# Altium project ST.PrjPcb
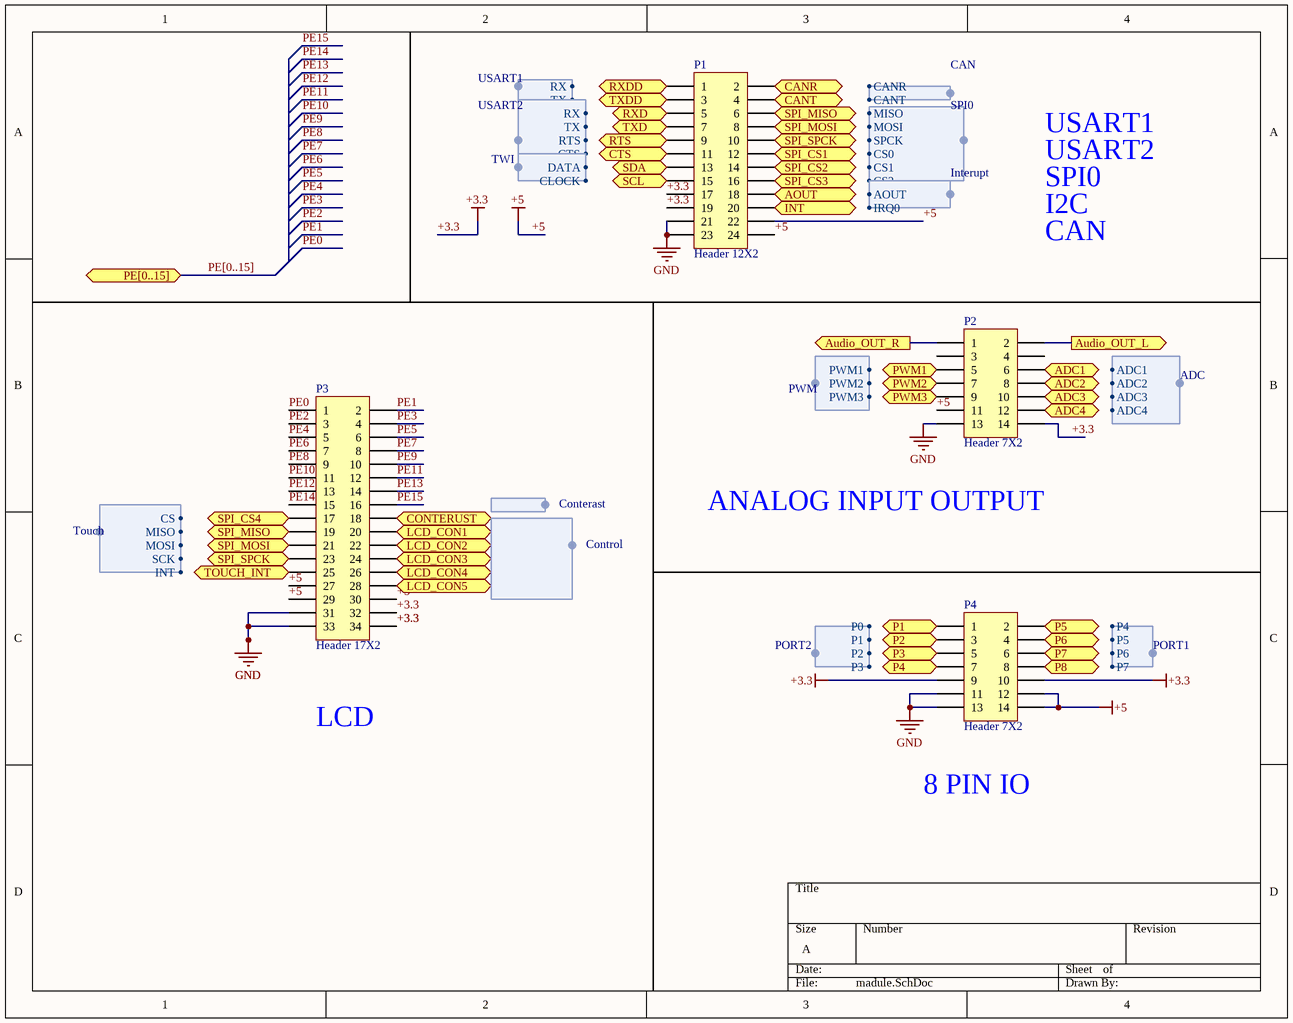
[diagram p0: madule.SchDoc]
1 sheet, 4 parts. Net scope: flat (ports and power ports of the same name join across sheets).
Board file: 94KA02-V1.PcbDoc

## Sheet madule.SchDoc
size A

### Parts
P1  Header 12X2  [IDC24S]
P2  Header 7X2  [IDC14S]
P3  Header 17X2  [IDC34S]
P4  Header 7X2  [IDC14S]

### Ports
ADC1 (out), ADC2 (out), ADC3 (out), ADC4 (out), AOUT (out), Audio_OUT_L (out), Audio_OUT_R (out), CANR (in), CANT (out), CONTERUST (in), CTS (in), INT (out), LCD_CON1 (in), LCD_CON2 (in), LCD_CON3 (in), LCD_CON4 (in), LCD_CON5 (in), P1 (bidir), P2 (bidir), P3 (bidir), P4 (bidir), P5 (bidir), P6 (bidir), P7 (bidir), P8 (bidir), PE[0..15] (bidir), PWM1 (in), PWM2 (in), PWM3 (in), RTS (out), RXD (out), RXDD (in), SCL (in), SDA (bidir), SPI_CS1 (in), SPI_CS2 (in), SPI_CS3 (in), SPI_CS4 (in), SPI_MISO (out), SPI_MOSI (in), SPI_SPCK (in), TOUCH_INT (in), TXD (in), TXDD (out)

### Harnesses
Conterast: 
Touch: CS, MISO, MOSI, SCK, INT
Control: 
USART1: RX, TX
USART2: TX, RX, RTS, CTS
TWI: DATA, CLOCK
CAN: CANR, CANT
SPI0: MISO, MOSI, SPCK, CS0, CS1, CS2
Interupt: AOUT, IRQ0
PORT2: P0, P1, P2, P3
PORT1: P4, P5, P6, P7
PWM: PWM1, PWM2, PWM3
ADC: ADC1, ADC2, ADC3, ADC4

### Nets
+3.3: P1.17 P1.19 P2.14 P3.32 P3.34 P4.9 P4.10
+5: P1.22 P1.24 P2.11 P3.27 P3.29 P3.30 P4.12 P4.14
GND: P1.21 P1.23 P2.13 P3.31 P3.33 P4.11 P4.13
PE0: P3.1
PE1: P3.2
PE2: P3.3
PE3: P3.4
PE4: P3.5
PE5: P3.6
PE6: P3.7
PE7: P3.8
PE8: P3.9
PE9: P3.10
PE10: P3.11
PE11: P3.12
PE12: P3.13
PE13: P3.14
PE14: P3.15
PE15: P3.16
NetP1_1: P1.1 ; port RXDD
NetP1_2: P1.2 ; port CANR
NetP1_3: P1.3 ; port TXDD
NetP1_4: P1.4 ; port CANT
NetP1_5: P1.5 ; port RXD
NetP1_6: P1.6 P3.19 ; port SPI_MISO
NetP1_7: P1.7 ; port TXD
NetP1_8: P1.8 P3.21 ; port SPI_MOSI
NetP1_9: P1.9 ; port RTS
NetP1_10: P1.10 P3.23 ; port SPI_SPCK
NetP1_11: P1.11 ; port CTS
NetP1_12: P1.12 ; port SPI_CS1
NetP1_13: P1.13 ; port SDA
NetP1_14: P1.14 ; port SPI_CS2
NetP1_15: P1.15 ; port SCL
NetP1_16: P1.16 ; port SPI_CS3
NetP1_18: P1.18 ; port AOUT
NetP1_20: P1.20 ; port INT
NetP2_1: P2.1 ; port Audio_OUT_R
NetP2_2: P2.2 ; port Audio_OUT_L
NetP2_5: P2.5 ; port PWM1
NetP2_6: P2.6 ; port ADC1
NetP2_7: P2.7 ; port PWM2
NetP2_8: P2.8 ; port ADC2
NetP2_9: P2.9 ; port PWM3
NetP2_10: P2.10 ; port ADC3
NetP2_12: P2.12 ; port ADC4
NetP3_17: P3.17 ; port SPI_CS4
NetP3_18: P3.18 ; port CONTERUST
NetP3_20: P3.20 ; port LCD_CON1
NetP3_22: P3.22 ; port LCD_CON2
NetP3_24: P3.24 ; port LCD_CON3
NetP3_25: P3.25 ; port TOUCH_INT
NetP3_26: P3.26 ; port LCD_CON4
NetP3_28: P3.28 ; port LCD_CON5
NetP4_1: P4.1 ; port P1
NetP4_2: P4.2 ; port P5
NetP4_3: P4.3 ; port P2
NetP4_4: P4.4 ; port P6
NetP4_5: P4.5 ; port P3
NetP4_6: P4.6 ; port P7
NetP4_7: P4.7 ; port P4
NetP4_8: P4.8 ; port P8

Not connected (* = marked no-connect by the designer): P2 3 4

### Buses and harness runs
bus PE[0..15] = port PE[0..15]

### Notes on the sheet
- USART1
- USART2
- SPI0
- I2C
- CAN
- ANALOG INPUT OUTPUT
- LCD
- 8 PIN IO

### Library data of the parts
P1 = Header 12X2: Header, 12-Pin, Dual row; LatestRevisionDate: 17-Jul-2002; LatestRevisionNote: Re-released for DXP Platform.; Publisher: Altium Limited
P2 P4 = Header 7X2: Header, 7-Pin, Dual row; LatestRevisionDate: 17-Jul-2002; LatestRevisionNote: Re-released for DXP Platform.; Publisher: Altium Limited
P3 = Header 17X2: Header, 17-Pin, Dual row; LatestRevisionDate: 17-Jul-2002; LatestRevisionNote: Re-released for DXP Platform.; Publisher: Altium Limited